# Altium schematic sheet Sensors.SchDoc
size A4
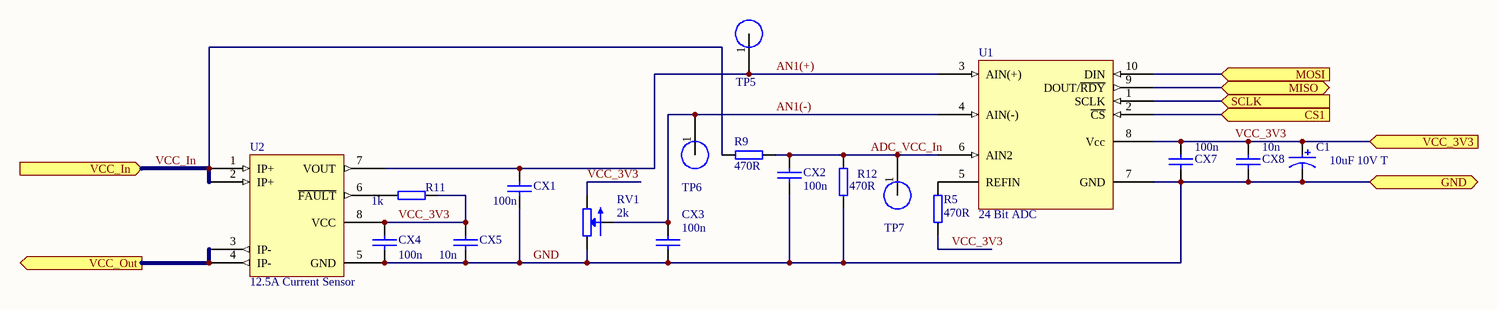
[diagram p0: Sensors.SchDoc]

## Parts
C1  10uF 10V T  [SMD-TANT-A]
CX1  100n  [0603]
CX2  100n  [0603]
CX3  100n  [0603]
CX4  100n  [0603]
CX5  10n  [0603]
CX7  100n  [0603]
CX8  10n  [0603]
R5  470R  [0603]
R9  470R  [0603]
R11  1k  [0603]
R12  470R  [0603]
RV1  2k  [VR3362P]
TP5  TestPad  [TestPad]  (value not drawn)
TP6  TestPad  [TestPad]  (value not drawn)
TP7  TestPad  [TestPad]  (value not drawn)
U1  24 Bit ADC  [MSOP-UN10_L]
U2  12.5A Current Sensor  [SO-8]

## Ports
CS1 (in), GND (bidir), MISO (bidir), MOSI (in), SCLK (in), VCC_3V3 (in), VCC_In (in), VCC_Out (out)

## Nets
ADC_VCC_In: CX2.1 R9.1 R12.2 TP7.1 U1.6(AIN2)
AN1(+): CX1.2 TP5.1 U1.3(AIN(+)) U2.7(VOUT)
AN1(-): CX3.2 RV1.W TP6.1 U1.4(AIN(-))
CS1: U1.2(~{CS}) ; port CS1
GND: C1.2 CX1.1 CX2.2 CX3.1 CX4.1 CX5.1 CX7.1 CX8.1 R12.1 RV1.CCW U1.7(GND) U2.5(GND) ; port GND
MISO: U1.9(DOUT/~{RDY}) ; port MISO
MOSI: U1.10(DIN) ; port MOSI
SCLK: U1.1(SCLK) ; port SCLK
VCC_3V3: C1.1 CX4.2 CX5.2 CX7.2 CX8.2 R5.2 R11.1 RV1.CW U1.8(Vcc) U2.8(VCC) ; port VCC_3V3
VCC_In: R9.2 U2.1(IP+) U2.2(IP+) ; port VCC_In
VCC_Out: U2.3(IP-) U2.4(IP-) ; port VCC_Out
NetR5_1: R5.1 U1.5(REFIN)
NetR11_2: R11.2 U2.6(~{FAULT})

## Library data of the parts
C1 = CAPACITOR POL-S
CX1 CX3-CX5 CX7 CX8 = CAP
CX2 = Cap
R5 R9 R11 R12 = res8
RV1 = RES6
TP5-TP7 = TestPad: Test Pad; Supplier1: N/A; PartNo1: N/A; PartNo2: N/A; Supplier2: N/A
U1 = AD7787BRMZ 24Bit ADC: AD7787BRMZ IC, 24BIT ADC, SMD, 7787, MSOP10; PartNo1: AD7787BRMZ-ND; Supplier2: E14; PartNo2: 1581940; Supplier1: Digi-Key
U2 = ACS711_12.5A_Current: ACS711; PartNo1: 620-1370-1-ND; PartNo2: 2057423; Supplier2: E14; Supplier1: Digi-Key